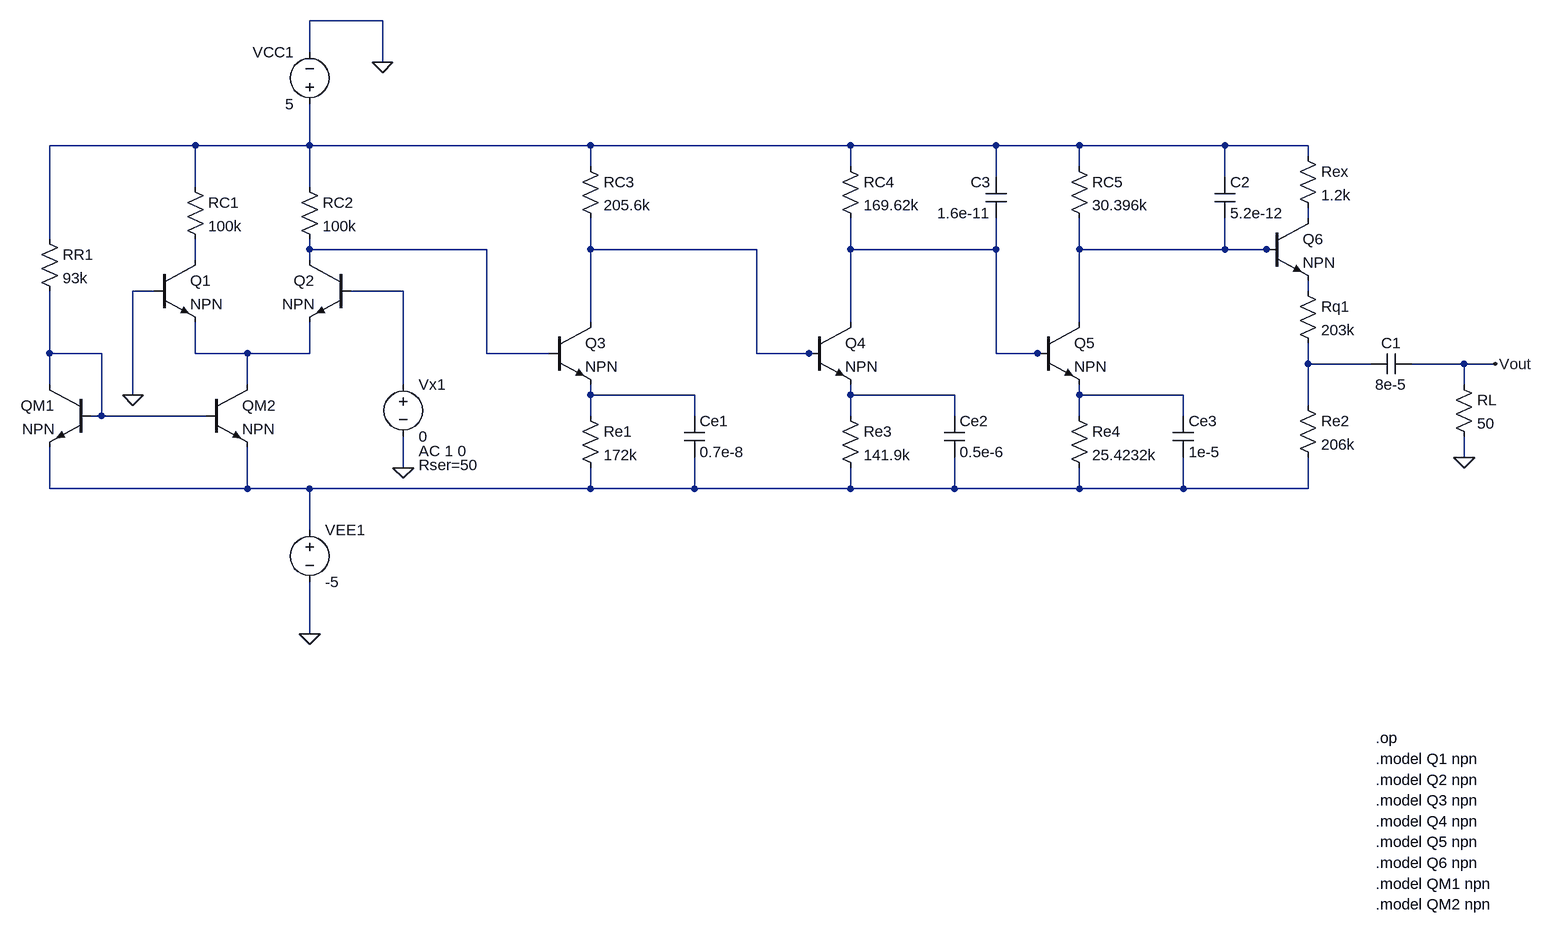
[diagram p0: schematic Small Signal Parameters.asc]
Small Signal Parameters.asc, the LTspice schematic file:
Version 4
SHEET 1 1920 1216
WIRE 64 -160 -48 -160
WIRE -48 -112 -48 -160
WIRE 64 -96 64 -160
WIRE -224 32 -448 32
WIRE -48 32 -48 -32
WIRE -48 32 -224 32
WIRE 384 32 -48 32
WIRE 784 32 384 32
WIRE 1008 32 784 32
WIRE 1136 32 1008 32
WIRE 1360 32 1136 32
WIRE 1488 32 1360 32
WIRE 1488 48 1488 32
WIRE 384 64 384 32
WIRE 784 64 784 32
WIRE 1136 64 1136 32
WIRE 1008 80 1008 32
WIRE 1360 80 1360 32
WIRE -224 96 -224 32
WIRE -48 96 -48 32
WIRE 1488 144 1488 128
WIRE -448 176 -448 32
WIRE -48 192 -48 176
WIRE 224 192 -48 192
WIRE 384 192 384 144
WIRE 640 192 384 192
WIRE 784 192 784 144
WIRE 1008 192 1008 144
WIRE 1008 192 784 192
WIRE 1136 192 1136 144
WIRE 1360 192 1360 144
WIRE 1360 192 1136 192
WIRE 1424 192 1360 192
WIRE 1440 192 1424 192
WIRE -224 208 -224 176
WIRE -48 208 -48 192
WIRE -288 256 -320 256
WIRE 96 256 16 256
WIRE 1488 256 1488 240
WIRE 384 304 384 192
WIRE 784 304 784 192
WIRE 1136 304 1136 192
WIRE -448 352 -448 256
WIRE -368 352 -448 352
WIRE -224 352 -224 304
WIRE -144 352 -224 352
WIRE -48 352 -48 304
WIRE -48 352 -144 352
WIRE 224 352 224 192
WIRE 320 352 224 352
WIRE 640 352 640 192
WIRE 720 352 640 352
WIRE 736 352 720 352
WIRE 1008 352 1008 192
WIRE 1072 352 1008 352
WIRE 1088 352 1072 352
WIRE 1488 368 1488 336
WIRE 1584 368 1488 368
WIRE 1728 368 1648 368
WIRE 1776 368 1728 368
WIRE -448 400 -448 352
WIRE -144 400 -144 352
WIRE 96 400 96 256
WIRE 1728 400 1728 368
WIRE -320 416 -320 256
WIRE 384 416 384 400
WIRE 544 416 384 416
WIRE 784 416 784 400
WIRE 944 416 784 416
WIRE 1136 416 1136 400
WIRE 1296 416 1136 416
WIRE 1488 432 1488 368
WIRE -368 448 -368 352
WIRE -368 448 -384 448
WIRE -208 448 -368 448
WIRE 384 448 384 416
WIRE 544 448 544 416
WIRE 784 448 784 416
WIRE 944 448 944 416
WIRE 1136 448 1136 416
WIRE 1296 448 1296 416
WIRE 1728 512 1728 480
WIRE 96 528 96 480
WIRE -448 560 -448 496
WIRE -144 560 -144 496
WIRE -144 560 -448 560
WIRE -48 560 -144 560
WIRE 384 560 384 528
WIRE 384 560 -48 560
WIRE 544 560 544 512
WIRE 544 560 384 560
WIRE 784 560 784 528
WIRE 784 560 544 560
WIRE 944 560 944 512
WIRE 944 560 784 560
WIRE 1136 560 1136 528
WIRE 1136 560 944 560
WIRE 1296 560 1296 512
WIRE 1296 560 1136 560
WIRE 1488 560 1488 512
WIRE 1488 560 1296 560
WIRE -48 624 -48 560
WIRE -48 784 -48 704
FLAG -48 784 0
FLAG 64 -96 0
FLAG 96 528 0
FLAG 1728 512 0
FLAG 1776 368 Vout
FLAG -320 416 0
DATAFLAG -48 192 "$"
DATAFLAG 384 192 "$"
DATAFLAG 800 192 "$"
DATAFLAG 1216 192 "$"
DATAFLAG 1488 368 "$"
DATAFLAG 1728 368 "$"
DATAFLAG -304 448 "$"
DATAFLAG 384 416 "$"
DATAFLAG 784 416 "$"
DATAFLAG 1136 416 "$"
DATAFLAG -144 352 "$"
DATAFLAG 96 256 "$"
DATAFLAG -320 256 "$"
DATAFLAG -48 64 "I(Rc2)"
DATAFLAG -224 64 "I(Rc1)"
DATAFLAG -448 112 "I(Rr1)"
DATAFLAG -144 528 "Ib(Qm2)"
DATAFLAG 384 48 "I(Rc3)"
DATAFLAG 784 48 "I(Rc4)"
DATAFLAG 384 544 "I(Re1)"
DATAFLAG 784 544 "I(Re3)"
DATAFLAG 1488 528 "I(Re2)"
DATAFLAG 1488 128 "I(Rex)"
DATAFLAG 1136 48 "I(Rc5)"
DATAFLAG 1728 496 "I(Rl)"
DATAFLAG 1136 544 "I(Re4)"
DATAFLAG 1488 256 "$"
SYMBOL res -240 80 R0
SYMATTR InstName RC1
SYMATTR Value 100k
SYMBOL res -64 80 R0
SYMATTR InstName RC2
SYMATTR Value 100k
SYMBOL Res 368 432 R0
SYMATTR InstName Re1
SYMATTR Value 172k
SYMBOL Res -464 160 R0
SYMATTR InstName RR1
SYMATTR Value 93k
SYMBOL Res 368 48 R0
SYMATTR InstName RC3
SYMATTR Value 205.6k
SYMBOL npn -288 208 R0
SYMATTR InstName Q1
SYMBOL npn 320 304 R0
SYMATTR InstName Q3
SYMBOL npn -208 400 R0
SYMATTR InstName QM2
SYMBOL npn -384 400 M0
SYMATTR InstName QM1
SYMBOL npn 16 208 M0
SYMATTR InstName Q2
SYMBOL voltage -48 608 R0
SYMATTR InstName VEE1
SYMATTR Value -5
SYMBOL voltage -48 -16 R180
WINDOW 0 24 96 Left 2
WINDOW 3 24 16 Left 2
SYMATTR InstName VCC1
SYMATTR Value 5
SYMBOL voltage 96 384 R0
WINDOW 123 24 118 Left 2
WINDOW 39 24 140 Left 2
SYMATTR Value2 AC 1 0
SYMATTR SpiceLine Rser=50
SYMATTR InstName Vx1
SYMATTR Value 0
SYMBOL cap 528 448 R0
SYMATTR InstName Ce1
SYMATTR Value 0.7e-8
SYMBOL Res 1472 416 R0
SYMATTR InstName Re2
SYMATTR Value 206k
SYMBOL Res 1712 384 R0
SYMATTR InstName RL
SYMATTR Value 50
SYMBOL cap 1648 352 R90
WINDOW 0 0 32 VBottom 2
WINDOW 3 32 32 VTop 2
SYMATTR InstName C1
SYMATTR Value 8e-5
SYMBOL Res 768 432 R0
SYMATTR InstName Re3
SYMATTR Value 141.9k
SYMBOL Res 768 48 R0
SYMATTR InstName RC4
SYMATTR Value 169.62k
SYMBOL npn 720 304 R0
SYMATTR InstName Q4
SYMBOL cap 928 448 R0
SYMATTR InstName Ce2
SYMATTR Value 0.5e-6
SYMBOL Res 1472 240 R0
SYMATTR InstName Rq1
SYMATTR Value 203k
SYMBOL Res 1120 432 R0
SYMATTR InstName Re4
SYMATTR Value 25.4232k
SYMBOL Res 1120 48 R0
SYMATTR InstName RC5
SYMATTR Value 30.396k
SYMBOL npn 1072 304 R0
SYMATTR InstName Q5
SYMBOL cap 1280 448 R0
SYMATTR InstName Ce3
SYMATTR Value 1e-5
SYMBOL cap 1344 80 R0
SYMATTR InstName C2
SYMATTR Value 5.2e-12
SYMBOL cap 1024 144 R180
WINDOW 0 24 56 Left 2
WINDOW 3 24 8 Left 2
SYMATTR InstName C3
SYMATTR Value 1.6e-11
SYMBOL npn 1424 144 R0
SYMATTR InstName Q6
SYMBOL Res 1472 32 R0
SYMATTR InstName Rex
SYMATTR Value 1.2k
TEXT 1592 944 Left 2 !.op
TEXT 1592 976 Left 2 !.model Q1 npn
TEXT 1592 1008 Left 2 !.model Q2 npn
TEXT 1592 1040 Left 2 !.model Q3 npn
TEXT 1592 1072 Left 2 !.model Q4 npn
TEXT 1592 1104 Left 2 !.model Q5 npn
TEXT 1592 1136 Left 2 !.model Q6 npn
TEXT 1592 1168 Left 2 !.model QM1 npn
TEXT 1592 1200 Left 2 !.model QM2 npn

The netlist it stands for:
* Small Signal Parameters.asc
RC1 N001 N007 100k
RC2 N001 N003 100k
Re1 N013 N016 172k
RR1 N001 N010 93k
RC3 N001 N004 205.6k
Q1 N007 0 N011 0 NPN
Q3 N004 N003 N013 0 NPN
QM2 N011 N010 N016 0 NPN
QM1 N010 N010 N016 0 NPN
Q2 N003 N008 N011 0 NPN
VEE1 N016 0 -5
VCC1 N001 0 5
Vx1 N008 0 0 AC 1 0 Rser=50
Ce1 N013 N016 0.7e-8
Re2 N012 N016 206k
RL Vout 0 50
C1 Vout N012 8e-5
Re3 N014 N016 141.9k
RC4 N001 N005 169.62k
Q4 N005 N004 N014 0 NPN
Ce2 N014 N016 0.5e-6
Rq1 N009 N012 203k
Re4 N015 N016 25.4232k
RC5 N001 N006 30.396k
Q5 N006 N005 N015 0 NPN
Ce3 N015 N016 1e-5
C2 N001 N006 5.2e-12
C3 N005 N001 1.6e-11
Q6 N002 N006 N009 0 NPN
Rex N001 N002 1.2k
.model NPN NPN
.model PNP PNP
.lib standard.bjt
.op
.model Q1 npn
.model Q2 npn
.model Q3 npn
.model Q4 npn
.model Q5 npn
.model Q6 npn
.model QM1 npn
.model QM2 npn
.backanno
.end